# Altium schematic sheet Relays.SchDoc
size 420 x 297 mm; SheetNumber: 9; SheetTotal: 11
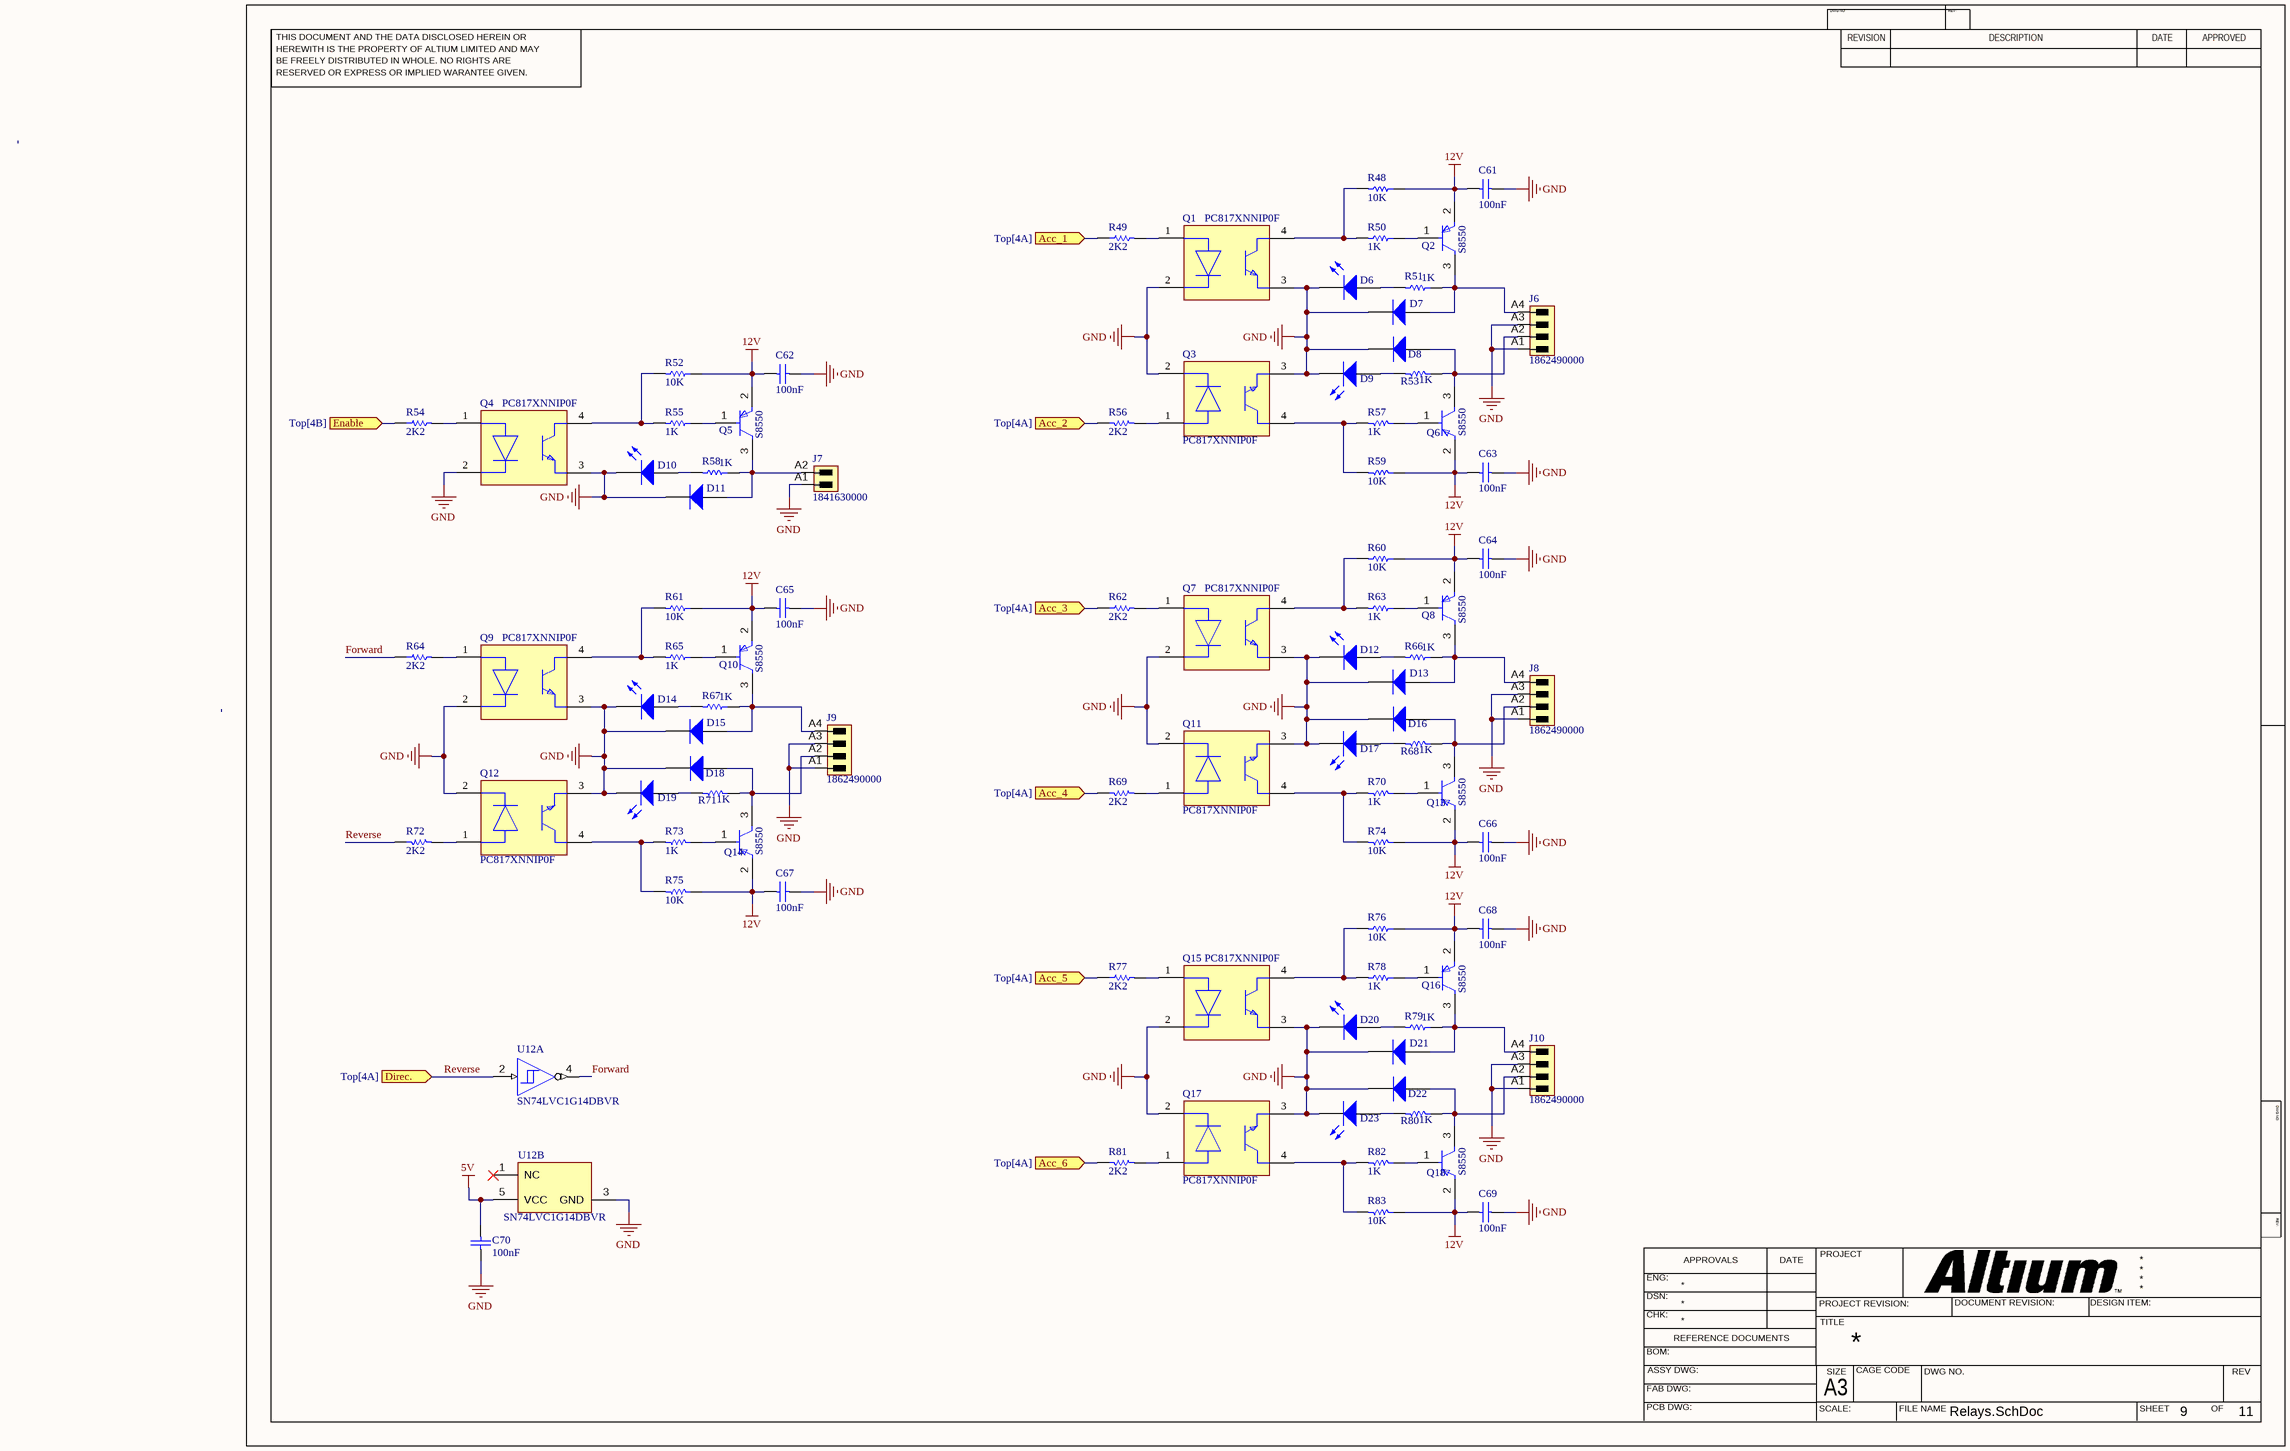
[diagram p0: Relays.SchDoc]

## Parts
C61  value 100nF  (hidden comment: Capacitor)
C62  value 100nF  (hidden comment: Capacitor)
C63  value 100nF  (hidden comment: Capacitor)
C64  value 100nF  (hidden comment: Capacitor)
C65  value 100nF  (hidden comment: Capacitor)
C66  value 100nF  (hidden comment: Capacitor)
C67  value 100nF  (hidden comment: Capacitor)
C68  value 100nF  (hidden comment: Capacitor)
C69  value 100nF  (hidden comment: Capacitor)
C70  value 100nF  (hidden comment: Capacitor)
D6  Light-Emitting Diode  (value not drawn)
D7  Diode  (value not drawn)
D8  Diode  (value not drawn)
D9  Light-Emitting Diode  (value not drawn)
D10  Light-Emitting Diode  (value not drawn)
D11  Diode  (value not drawn)
D12  Light-Emitting Diode  (value not drawn)
D13  Diode  (value not drawn)
D14  Light-Emitting Diode  (value not drawn)
D15  Diode  (value not drawn)
D16  Diode  (value not drawn)
D17  Light-Emitting Diode  (value not drawn)
D18  Diode  (value not drawn)
D19  Light-Emitting Diode  (value not drawn)
D20  Light-Emitting Diode  (value not drawn)
D21  Diode  (value not drawn)
D22  Diode  (value not drawn)
D23  Light-Emitting Diode  (value not drawn)
J6  1862490000  [SC_SMT_3_81_90G_04]
J7  1841630000  [SL_SMT_3_5_90G_02]
J8  1862490000  [SC_SMT_3_81_90G_04]
J9  1862490000  [SC_SMT_3_81_90G_04]
J10  1862490000  [SC_SMT_3_81_90G_04]
Q1  PC817XNNIP0F  [FP-PC817XNNIP0F-MFG]
Q2  S8550  [FP-SOT-23-IPC_B]
Q3  PC817XNNIP0F  [FP-PC817XNNIP0F-MFG]
Q4  PC817XNNIP0F  [FP-PC817XNNIP0F-MFG]
Q5  S8550  [FP-SOT-23-IPC_B]
Q6  S8550  [FP-SOT-23-IPC_B]
Q7  PC817XNNIP0F  [FP-PC817XNNIP0F-MFG]
Q8  S8550  [FP-SOT-23-IPC_B]
Q9  PC817XNNIP0F  [FP-PC817XNNIP0F-MFG]
Q10  S8550  [FP-SOT-23-IPC_B]
Q11  PC817XNNIP0F  [FP-PC817XNNIP0F-MFG]
Q12  PC817XNNIP0F  [FP-PC817XNNIP0F-MFG]
Q13  S8550  [FP-SOT-23-IPC_B]
Q14  S8550  [FP-SOT-23-IPC_B]
Q15  PC817XNNIP0F  [FP-PC817XNNIP0F-MFG]
Q16  S8550  [FP-SOT-23-IPC_B]
Q17  PC817XNNIP0F  [FP-PC817XNNIP0F-MFG]
Q18  S8550  [FP-SOT-23-IPC_B]
R48  value 10K  (hidden comment: Resistor)
R49  value 2K2  (hidden comment: Resistor)
R50  value 1K  (hidden comment: Resistor)
R51  value 1K  (hidden comment: Resistor)
R52  value 10K  (hidden comment: Resistor)
R53  value 1K  (hidden comment: Resistor)
R54  value 2K2  (hidden comment: Resistor)
R55  value 1K  (hidden comment: Resistor)
R56  value 2K2  (hidden comment: Resistor)
R57  value 1K  (hidden comment: Resistor)
R58  value 1K  (hidden comment: Resistor)
R59  value 10K  (hidden comment: Resistor)
R60  value 10K  (hidden comment: Resistor)
R61  value 10K  (hidden comment: Resistor)
R62  value 2K2  (hidden comment: Resistor)
R63  value 1K  (hidden comment: Resistor)
R64  value 2K2  (hidden comment: Resistor)
R65  value 1K  (hidden comment: Resistor)
R66  value 1K  (hidden comment: Resistor)
R67  value 1K  (hidden comment: Resistor)
R68  value 1K  (hidden comment: Resistor)
R69  value 2K2  (hidden comment: Resistor)
R70  value 1K  (hidden comment: Resistor)
R71  value 1K  (hidden comment: Resistor)
R72  value 2K2  (hidden comment: Resistor)
R73  value 1K  (hidden comment: Resistor)
R74  value 10K  (hidden comment: Resistor)
R75  value 10K  (hidden comment: Resistor)
R76  value 10K  (hidden comment: Resistor)
R77  value 2K2  (hidden comment: Resistor)
R78  value 1K  (hidden comment: Resistor)
R79  value 1K  (hidden comment: Resistor)
R80  value 1K  (hidden comment: Resistor)
R81  value 2K2  (hidden comment: Resistor)
R82  value 1K  (hidden comment: Resistor)
R83  value 10K  (hidden comment: Resistor)
U12  SN74LVC1G14DBVR  [DBV0005A_L]  (parts A,B of 2)

## Ports
Acc_1 (in, see Top[4A]), Acc_2 (in, see Top[4A]), Acc_3 (in, see Top[4A]), Acc_4 (in, see Top[4A]), Acc_5 (in, see Top[4A]), Acc_6 (in, see Top[4A]), Direc. (in, see Top[4A]), Enable (in, see Top[4B])

## Nets
5V: C70.1 U12.5(VCC)
12V: C61.1 C62.1 C63.1 C64.1 C65.1 C66.1 C67.1 C68.1 C69.1 Q2.2(E) Q5.2(E) Q6.2(E) Q8.2(E) Q10.2(E) Q13.2(E) Q14.2(E) Q16.2(E) Q18.2(E) R48.1 R52.1 R59.1 R60.1 R61.1 R74.1 R75.1 R76.1 R83.1
GND: C61.2 C62.2 C63.2 C64.2 C65.2 C66.2 C67.2 C68.2 C69.2 C70.2 D6.2(K) D7.2(K) D8.2(K) D9.2(K) D10.2(K) D11.2(K) D12.2(K) D13.2(K) D14.2(K) D15.2(K) D16.2(K) D17.2(K) D18.2(K) D19.2(K) D20.2(K) D21.2(K) D22.2(K) D23.2(K) J6.A1 J6.A3 J7.A1 J8.A1 J8.A3 J9.A1 J9.A3 J10.A1 J10.A3 Q1.2(C) Q1.3(E) Q3.2(C) Q3.3(E) Q4.2(C) Q4.3(E) Q7.2(C) Q7.3(E) Q9.2(C) Q9.3(E) Q11.2(C) Q11.3(E) Q12.2(C) Q12.3(E) Q15.2(C) Q15.3(E) Q17.2(C) Q17.3(E) U12.3(GND)
Acc_1: R49.1 ; port Acc_1
Acc_2: R56.1 ; port Acc_2
Acc_3: R62.1 ; port Acc_3
Acc_4: R69.1 ; port Acc_4
Acc_5: R77.1 ; port Acc_5
Acc_6: R81.1 ; port Acc_6
Enable: R54.1 ; port Enable
Forward: R64.1 U12.4(Y)
Reverse: R72.1 U12.2(A) ; port Direc.
NetD6_1: D6.1(A) R51.2
NetD7_1: D7.1(A) J6.A4 Q2.3(C) R51.1
NetD8_1: D8.1(A) J6.A2 Q6.3(C) R53.1
NetD9_1: D9.1(A) R53.2
NetD10_1: D10.1(A) R58.2
NetD11_1: D11.1(A) J7.A2 Q5.3(C) R58.1
NetD12_1: D12.1(A) R66.2
NetD13_1: D13.1(A) J8.A4 Q8.3(C) R66.1
NetD14_1: D14.1(A) R67.2
NetD15_1: D15.1(A) J9.A4 Q10.3(C) R67.1
NetD16_1: D16.1(A) J8.A2 Q13.3(C) R68.1
NetD17_1: D17.1(A) R68.2
NetD18_1: D18.1(A) J9.A2 Q14.3(C) R71.1
NetD19_1: D19.1(A) R71.2
NetD20_1: D20.1(A) R79.2
NetD21_1: D21.1(A) J10.A4 Q16.3(C) R79.1
NetD22_1: D22.1(A) J10.A2 Q18.3(C) R80.1
NetD23_1: D23.1(A) R80.2
NetQ1_1: Q1.1(A) R49.2
NetQ1_4: Q1.4(C) R48.2 R50.2
NetQ2_1: Q2.1(B) R50.1
NetQ3_1: Q3.1(A) R56.2
NetQ3_4: Q3.4(C) R57.2 R59.2
NetQ4_1: Q4.1(A) R54.2
NetQ4_4: Q4.4(C) R52.2 R55.2
NetQ5_1: Q5.1(B) R55.1
NetQ6_1: Q6.1(B) R57.1
NetQ7_1: Q7.1(A) R62.2
NetQ7_4: Q7.4(C) R60.2 R63.2
NetQ8_1: Q8.1(B) R63.1
NetQ9_1: Q9.1(A) R64.2
NetQ9_4: Q9.4(C) R61.2 R65.2
NetQ10_1: Q10.1(B) R65.1
NetQ11_1: Q11.1(A) R69.2
NetQ11_4: Q11.4(C) R70.2 R74.2
NetQ12_1: Q12.1(A) R72.2
NetQ12_4: Q12.4(C) R73.2 R75.2
NetQ13_1: Q13.1(B) R70.1
NetQ14_1: Q14.1(B) R73.1
NetQ15_1: Q15.1(A) R77.2
NetQ15_4: Q15.4(C) R76.2 R78.2
NetQ16_1: Q16.1(B) R78.1
NetQ17_1: Q17.1(A) R81.2
NetQ17_4: Q17.4(C) R82.2 R83.2
NetQ18_1: Q18.1(B) R82.1

Not connected (* = marked no-connect by the designer): U12 1(NC)*

## Notes on the sheet
- THIS DOCUMENT AND THE DATA DISCLOSED HEREIN OR
- HEREWITH IS THE PROPERTY OF ALTIUM LIMITED AND MAY
- DWG NO:
- REVISION
- REV:
- DESCRIPTION
- DATE
- APPROVED
- BE FREELY DISTRIBUTED IN WHOLE. NO RIGHTS ARE
- RESERVED OR EXPRESS OR IMPLIED WARANTEE GIVEN.
- ENG:
- APPROVALS
- PROJECT
- DSN:
- CHK:
- REFERENCE DOCUMENTS
- PROJECT REVISION:
- TITLE
- DOCUMENT REVISION:
- DESIGN ITEM:
- BOM:
- FAB DWG:
- PCB DWG:
- ASSY DWG:
- SCALE:
- A3
- SIZE
- CAGE CODE
- FILE NAME
- DWG NO.
- SHEET
- OF
- REV

## Library data of the parts
C61-C70 = Capacitor: SimulationGenericComponent: True; Supplier 1: Arrow Electronics
D6 D9 D10 D12 D14 D17 D19 D20 D23 = LED: AF: 1; BV: 0; BV_MAX: 1e99; EG: 1.11; FC: 0.5; IBV: 0.001; IS: 1e-14; MJSW: 0.33; NTUN: 30; TNOM: 27; XTI: 3; SimulationGenericComponent: True; CJO: 0; CJP: 0; CTA: 0; CTP: 0; FCS: 0.5; FV_MAX: 1e99; IKF: 0; IKR: 0; ISR: 1e-14; JSW: 0; JTUN: 0; JTUNSW: 0; KEG: 1; KF: 0; LEVEL: 1; N: 1; NBV: 1; NR: 1; NS: 1; PHP: 1; RS: 0; TCV: 0; TLEV: 0; TLEVC: 0; TM1: 0; TM2: 0; TPB: 0; TPHP: 0; TRS: 0; TRS2: 0; TT: 0; TTT1: 0; TTT2: 0; VJ: 1; XTITUN: 3
D7 D8 D11 D13 D15 D16 D18 D21 D22 = Diode: AF: 1; BV: 0; BV_MAX: 1e99; EG: 1.11; FC: 0.5; IBV: 0.001; ISR: 1e-14; MJSW: 0.33; NTUN: 30; TNOM: 27; XTI: 3; SimulationGenericComponent: True; CJO: 0; CJP: 0; CTA: 0; CTP: 0; FCS: 0.5; FV_MAX: 1e99; IKF: 0; IKR: 0; JSW: 0; JTUN: 0; JTUNSW: 0; KEG: 1; KF: 0; LEVEL: 1; N: 1; NBV: 1; NR: 1; NS: 1; PHP: 1; RS: 0; TCV: 0; TLEV: 0; TLEVC: 0; TM1: 0; TM2: 0; TPB: 0; TPHP: 0; TRS: 0; TRS2: 0; TT: 0; TTT1: 0; TTT2: 0; VJ: 1; XTITUN: 3; IS: 1e-14
J6 J8-J10 = CMP-1559-00524-1: OMNIMATE Signal - series BC/SC 3.81; Manufacturer: Weidmueller; Side_termination_characteristic: closed side; Pitch_mm: 3.81 mm; UL_94_flammability_rating: V-0; Outgoing_elbow: 90°; Rated_voltage_use_group_B_UL_1059: 300 V; No_of_poles: 4; Rated_current_min_no_of_poles_TU_20_deg_C: 19 A; Rated_current_use_group_B_UL_1059: 10 A; Solder_pin_length_mm: 3.2 mm; Contact_surface: tinned; Contact_material: Cu-Leg; Rated_voltage_for_surge_voltage_class_pollution_degree_II_2: 320 V; Mounting_onto_the_PCB: Reflow solder connection; Short_text_for_material: SC-SMT 3.81/04/90G 3.2SN BK BX; Insulating_material: LCP GF; Pitch_inch: 0.15 inch; ComponentLink2Description: URL Link1; Qty: 50 PCS; Colour: Black; ComponentLink1URL: http://www.weidmueller.com/; Packaging: Box; PackageReference: SC_SMT_3_81_90G_04; ComponentLink1Description: Manufacturer URL; ComponentLink2URL: http://catalog.weidmueller.com/catalog/Start.do?localeId=en&ObjectID=1862490000; PartNumber: 1862490000; Revision: V1
J7 = CMP-1559-01184-1: OMNIMATE Signal - series BL/SL 3.50; Manufacturer: Weidmueller; Rated_voltage_use_group_B_UL_1059: 300 V; Mounting_onto_the_PCB: Reflow solder connection; Rated_current_min_no_of_poles_TU_20_deg_C: 15 A; Pitch_mm: 3.5 mm; Insulating_material: LCP GF; Pitch_inch: 0.138 inch; Rated_voltage_for_surge_voltage_class_pollution_degree_II_2: 320 V; Short_text_for_material: SL-SMT 3.50/02/90G 3.2SN BK BX; No_of_poles: 2; Contact_surface: tinned; Side_termination_characteristic: closed side; Rated_current_use_group_B_UL_1059: 10 A; UL_94_flammability_rating: V-0; Outgoing_elbow: 90°; Solder_pin_length_mm: 3.2 mm; Revision: V1; Qty: 100 PCS; ComponentLink2URL: http://catalog.weidmueller.com/catalog/Start.do?localeId=en&ObjectID=1841630000; Packaging: Box; Colour: Black; PackageReference: SL_SMT_3_5_90G_02; PartNumber: 1841630000; ComponentLink1Description: Manufacturer URL; ComponentLink1URL: http://www.weidmueller.com/; ComponentLink2Description: URL Link1
Q1 Q3 Q4 Q7 Q9 Q11 Q12 Q15 Q17 = CMP-65434-000005-1: OPTOISOLATOR 5KV TRANS 4SMD; Reverse Breakdown Voltage: 6V; Output Current per Channel: 30mA; Power Dissipation: 200mW; Collector-emitter Voltage-Max: 200mV; Max Output Voltage: 80V; Input Current: 50mA; Forward Voltage: 1.4V; Fall Time: 18000ns; Number of Elements: 1; Input Type: DC; Packaging: Tape and Reel; RoHS Compliant: Yes; Contact Plating: Copper; Min Operating Temperature: -30°C; Collector Emitter Saturation Voltage: 200mV; Max Input Current: 50mA; Radiation Hardening: No; Max Collector Current: 50mA; Case/Package: SMD/SMT; Mount: Surface Mount; Output Voltage: 80V; Forward Current: 50mA; Max Power Dissipation: 200mW; Collector Emitter Voltage (VCEO): 80V; Number of Channels: 1; Rise Time: 18000ns; Isolation Voltage: 5kV; Number of Pins: 4; Lead Free: Lead Free; Package Quantity: 2000; Isolation Voltage-Max: 5kV; Max Operating Temperature: 100°C
Q2 Q5 Q6 Q8 Q10 Q13 Q14 Q16 Q18 = CMP-56214-000002-1: TRANS PNP 25V 1.5A SOT23; Emitter Base Voltage (VEBO): 1.6V; Collector Base Voltage (VCBO): 40V; Collector Emitter Saturation Voltage: 500mV; Max Power Dissipation: 625mW; Transition Frequency: 100MHz; Element Configuration: Single; hFE Min: 40; Polarity: PNP; Lead Free: Lead Free; Max Breakdown Voltage: 25V; Package Quantity: 1; Min Operating Temperature: -55°C; Case/Package: SOT-23; Max Collector Current: 1.5A; Mount: Surface Mount; Packaging: Tape and Reel; Collector Emitter Voltage (VCEO): 500mV; Max Operating Temperature: 150°C; Gain Bandwidth Product: 100MHz; Collector Emitter Breakdown Voltage: 25V
R48-R83 = Resistor: TC1: 0; SimulationGenericComponent: True; TC2: 0
U12 = CMP-0859-00030-4: Single Schmitt-Trigger Inverter, DBV0005A, LARGE T&R; Manufacturer: Texas Instruments; Input Type: CMOS/TTL; Output Drive (IOL/IOH)(Max)(mA): 32/-32; VCC(Min)(V): 1.65; 3-State Output: No; Schmitt Trigger: Yes; tpd @ Nom Voltage(Max)(ns): 11,6.5,5.5,5; VCC(Max)(V): 5.5; Output Type: CMOS; Bits(#): 1; Voltage(Nom)(V): 1.8,2.5,3.3,5; Sub-Family: Inverting Buffer/Driver; Logic: Inverting; Technology Family: LVC; F @ Nom Voltage(Max)(Mhz): 150; Rating: Catalog; ICC @ Nom Voltage(Max)(mA): 0.01; DatasheetVersion: SCES218W; PackageReference: DBV0005A; Generic Part Number: SN74LVC1G14; Operating Temperature Range(C): -40 to 125,-40 to 85